# Altium schematic sheet MDQARM_USB_UART.SchDoc
size A4
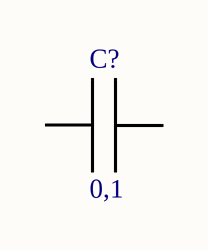
[diagram p0: MDQARM_USB_UART.SchDoc]

## Parts
C?  0,1  [Capacitor SMD0805]

## Nets

Not connected (* = marked no-connect by the designer): C? 1 2

## Library data of the parts
C? = Capacitor C0805_100n: Value: 0,1